# Altium schematic sheet 3V-Switcher-50mA.SCHDOC
size A4; Organization: UNSW Solar Racing Team; Address3: UNSW; Address4: Sydney NSW 2052; Address2: Electrical Engineering; Address1: Rm 109
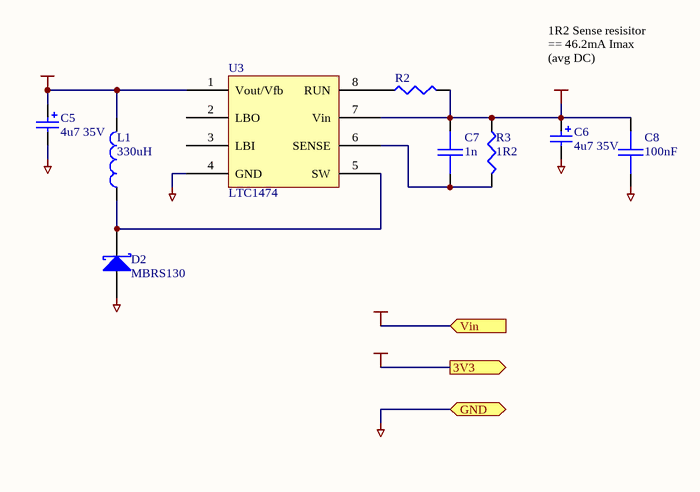
[diagram p0: 3V-Switcher-50mA.SCHDOC]

## Parts
C5  4u7 35V  [MCCT-CASEC]
C6  4u7 35V  [MCCT-CASEC]
C7  1n  [0603]
C8  100nF  [0603]
D2  MBRS130  [SMB]
L1  330uH  [1812]
R2  100k  [0603]  (value not drawn)
R3  1R2  [0603]
U3  LTC1474  [TSOP8]

## Ports
3V3 (out), GND (bidir), Vin (in)

## Nets
3V3: C5.1 L1.2 U3.1(Vout/Vfb) ; port 3V3
GND: C5.2 C6.2 C8.2 D2.A U3.4(GND) ; port GND
Vin: C6.1 C7.1 C8.1 R2.2 R3.1 U3.7(Vin) ; port Vin
NetC7_2: C7.2 R3.2 U3.6(SENSE)
NetD2_K: D2.K L1.1 U3.5(SW)
NetR2_1: R2.1 U3.8(RUN)

Not connected (* = marked no-connect by the designer): U3 2(LBO) 3(LBI)

## Notes on the sheet
- 1R2 Sense resisitor == 46.2mA Imax (avg DC)
- Title
- Size:
- Date:
- A4
- Number:
- Time:
- Revision:
- Sheet
- of
- File:

## Library data of the parts
C5 C6 = Cap Pol3: Polarized Capacitor (Surface Mount); Order#: 197-609; Revision: July-2002: Re-released for DXP Platform.; Price: 1.41; Supplier: Farnell
C7 = CAP: Capacitor; Order#: 317-202; Revision: July-2002: Re-released for DXP Platform.; Price: 0.15; Supplier: Farnell
C8 = CAP: Capacitor; Revision: July-2002: Re-released for DXP Platform.; Supplier: Stock
D2 = D SCHOTTKY: Schottky Diode; Order#: 9556931; Revision: July-2002: Re-released for DXP Platform.; Price: 1.49; Supplier: Farnell
L1 = Inductor: Order#: 8808538; Revision: July-2002: Re-released for DXP Platform.; Price: 1.96; Supplier: Farnell
R2 = RES1: Resistor; Order#: 933-3738; Price: 0.13; Supplier: Farnell
R3 = RES1: Resistor; Order#: 139-9658; Revision: July-2002: Re-released for DXP Platform.; Price: 0.63; Supplier: Farnell
U3 = LTC1474: Step-down converter; Order#: LTC1474CMS8-3.3-ND; Price: 7.50USD; Supplier: Digikey